# Altium schematic sheet DOAN2.SchDoc
size A4; SheetNumber: 1; SheetTotal: 1
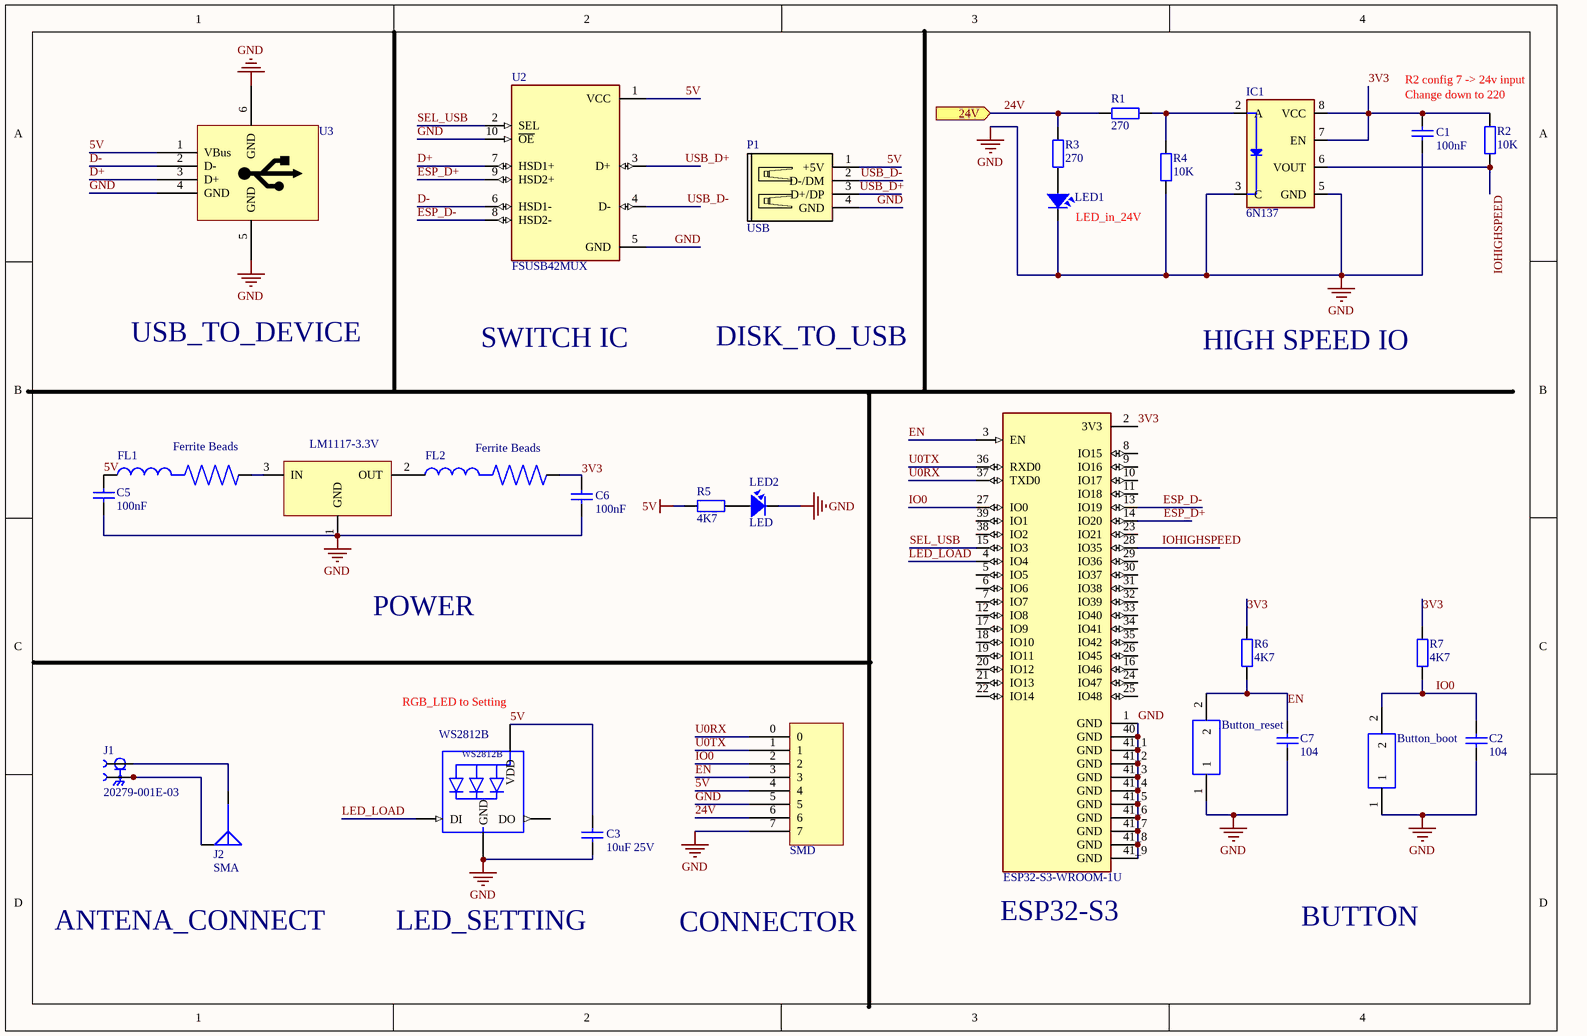
[diagram p0: DOAN2.SchDoc]

## Parts
5V-3V3  LM1117-3.3V  [LM1117-SOP]  (value not drawn)
*  SMD  [PCBComponent_1]  (part B of 2)
Button_boot  Component_1  [PCBComponent_1]  (value not drawn)
Button_reset  Component_1  [PCBComponent_1]  (value not drawn)
C1  100nF  [tu 0805]
C2  104  [tu 0805]
C3  10uF 25V  [tu 0805]
C5  100nF  [tu 0805]
C6  100nF  [tu 0805]
C7  104  [tu 0805]
FL1  BLM21SP111SH1D  [BEADC2012X105N]  (value not drawn)
FL2  BLM21SP111SH1D  [BEADC2012X105N]  (value not drawn)
IC1  6N137  [COUPL_6N138SDM]
J1  20279-001E-03  [IPEX_20279-001E-03]
J2  SMA  [LINX CONREVSMA003.062]
LED  WS2812B  [WS2812B]
LED1  LED_in_24V  [SM-LED-0805-Blue]
LED2  LED  [SM-LED-0805-Blue]
P1  USB  [USB-A-FEMALE-SMD]
R1  270  [tro smd 0603]
R2  10K  [tro smd 0603]
R3  270  [tro smd 0603]
R4  10K  [tro smd 0603]
R5  4K7  [RES-SMD-0805]
R6  4K7  [RES-SMD-0805]
R7  4K7  [RES-SMD-0805]
U2  FSUSB42MUX  [SOP50P490X110-10N]
U3  USB-A Through-Hole  [USB-A]  (value not drawn)
U4  ESP32-S3-WROOM-1U  [XCVR_ESP32-S3-WROOM-1U]

## Ports
24V (in)

## Nets
5V: *.4 C3.1 C5.1 FL1.1 LED.1-VDD(VDD) P1.1(+5V) R5.2 U2.1(VCC) U3.1(VBus)
GND: 5V-3V3.1(GND) *.5 *.7 Button_boot.1 Button_reset.1 C1.2 C2.2 C3.2 C5.2 C6.2 C7.2 IC1.3(C) IC1.5(GND) LED.3-GND(GND) LED1.2 LED2.2 P1.4(GND) R4.1 U2.5(GND) U2.10(~{OE}) U3.4(GND) U3.5(GND) U3.6(GND) U4.1(GND) U4.40(GND) U4.41_1(GND) U4.41_2(GND) U4.41_3(GND) U4.41_4(GND) U4.41_5(GND) U4.41_6(GND) U4.41_7(GND) U4.41_8(GND) U4.41_9(GND)
3V3: C1.1 C6.1 FL2.2 IC1.7(EN) IC1.8(VCC) R2.2 R6.2 R7.2 U4.2(3V3)
24V: *.6 R1.1 R3.2 ; port 24V
D+: U2.7(HSD1+) U3.3(D+)
D-: U2.6(HSD1-) U3.2(D-)
EN: *.3 Button_reset.2 C7.1 R6.1 U4.3(EN)
ESP_D+: U2.9(HSD2+) U4.14(IO20)
ESP_D-: U2.8(HSD2-) U4.13(IO19)
IO0: *.2 Button_boot.2 C2.1 R7.1 U4.27(IO0)
IOHIGHSPEED: IC1.6(VOUT) R2.1 U4.28(IO35)
LED_LOAD: LED.4-DIN(DI) U4.4(IO4)
SEL_USB: U2.2(SEL) U4.15(IO3)
U0RX: *.0 U4.37(TXD0)
U0TX: *.1 U4.36(RXD0)
USB_D+: P1.3(D+/DP) U2.3(D+)
USB_D-: P1.2(D-/DM) U2.4(D-)
Net5V-3V3_2: 5V-3V3.2(OUT) FL2.1
Net5V-3V3_3: 5V-3V3.3(IN) FL1.2
NetIC1_2: IC1.2(A) R1.2 R4.2
NetJ1_1: J1.1(SIGNAL) J2.S
NetJ1_2: J1.2(GROUND) J1.3(GROUND) J2.G
NetLED1_1: LED1.1 R3.1
NetLED2_1: LED2.1 R5.1

Not connected (* = marked no-connect by the designer): LED 2-DOUT(DO); U4 5(IO5) 6(IO6) 7(IO7) 8(IO15) 9(IO16) 10(IO17) 11(IO18) 12(IO8) 16(IO46) 17(IO9) 18(IO10) 19(IO11) 20(IO12) 21(IO13) 22(IO14) 23(IO21) 24(IO47) 25(IO48) 26(IO45) 29(IO36) 30(IO37) 31(IO38) 32(IO39) 33(IO40) 34(IO41) 35(IO42) 38(IO2) 39(IO1)

## Notes on the sheet
- Change down to 220
- R2 config 7 -> 24v input
- USB_TO_DEVICE
- SWITCH IC
- DISK_TO_USB
- HIGH SPEED IO
- (near FL1) Ferrite Beads
- (near 5V-3V3) LM1117-3.3V
- (near FL2) Ferrite Beads
- POWER
- (near LED) RGB_LED to Setting
- (near U4) ESP32-S3
- ANTENA_CONNECT
- LED_SETTING
- CONNECTOR
- BUTTON

## Library data of the parts
5V-3V3 = LM1117: 800mA Low-Dropout Linear Regulator; Creator: Nguyen Ba Bien; Website: http://group3i.net
* IC1 = Component_1
C1-C3 C5-C7 = Tu 0805 104 50V 10%: Dán; Don_Vi: Con; So_Chan: 2; Ten_Linh_Kien: Tụ 0805 104-100nF 10% 50V; Ma_Hang: MH004551; Chung_Loai: Dán; Kieu_Chan: *
J1 = 20279-001E-03: 1 POS Vertical SMD Small form factor with big performance through 6 GHz connector,MHF, RF, micro-coaxial MHF I Receptacle; MF: I-PEX; SnapEDA_Link: https://www.snapeda.com/parts/20279-001E-03/I-PEX/view-part/?ref=snap; Package: None; Value: *; MP: 20279-001E-03; Check_prices: https://www.snapeda.com/parts/20279-001E-03/I-PEX/view-part/?ref=eda
J2 = RF Connector - SMA
LED = WS2812B: Raspberry Pi HAT _40 pin_ Wheeled Robotics Kit; MF: SparkFun Electronics; Availability: Unavailable; SnapEDA_Link: https://www.snapeda.com/parts/WS2812B/Worldsemi/view-part/1038297/?ref=snap; MP: WS2812B; Price: None; Value: *; Package: None
LED1 = LED
R1-R4 = Tro 0603 5% 1k: Dán; Don_Vi: Con; So_Chan: 2; Ten_Linh_Kien: Trở 0603 5% 1k; Ma_Hang: MH006319; Chung_Loai: Dán; Kieu_Chan: *
R5-R7 = R: Resistor R1/4W
U2 = FSUSB42MUX: FSUSB42 Series DPDT 4.3 V 480 Mbps SMT Hi Speed USB 2.0 Switch - MSOP-10; MF: ON Semiconductor; SnapEDA_Link: https://www.snapeda.com/parts/FSUSB42MUX/Onsemi/view-part/?ref=snap; Package: MSOP-10 ON Semiconductor; Value: *; MP: FSUSB42MUX; Check_prices: https://www.snapeda.com/parts/FSUSB42MUX/Onsemi/view-part/?ref=eda
U3 = USB-A TH
U4 = ESP32-S3-WROOM-1U: 2.4 GHz Wi-Fi (802.11 b/g/n) and Bluetooth 5 (LE) module; MF: Espressif Systems; Value: *; Package: Package; Check_prices: https://www.snapeda.com/parts/ESP32-S3-WROOM-1U/Espressif+Systems/view-part/?ref=eda; Price: None; MP: ESP32-S3-WROOM-1U; Availability: Not in stock; SnapEDA_Link: https://www.snapeda.com/parts/ESP32-S3-WROOM-1U/Espressif+Systems/view-part/?ref=snap
FL1 FL2 = BLM21SP111SH1D: Package: None; Price: None; Value: *; MP: BLM21SP111SH1D; Availability: Unavailable